# Altium project sonata-board.PrjPcb (part 2 of 2)

## Sheet sb-sonata-fpganaalog.SchDoc: FPGA Analog + 1.8V Bank
size Letter; Organization: NewAE Technology Inc.; Address1: 1083 Queen St., Suite 196; Address2: Halifax; Address3: NS; Address4: Canada B3H 0B2; SheetNumber: 15; SheetTotal: 20; SheetApproved: YES
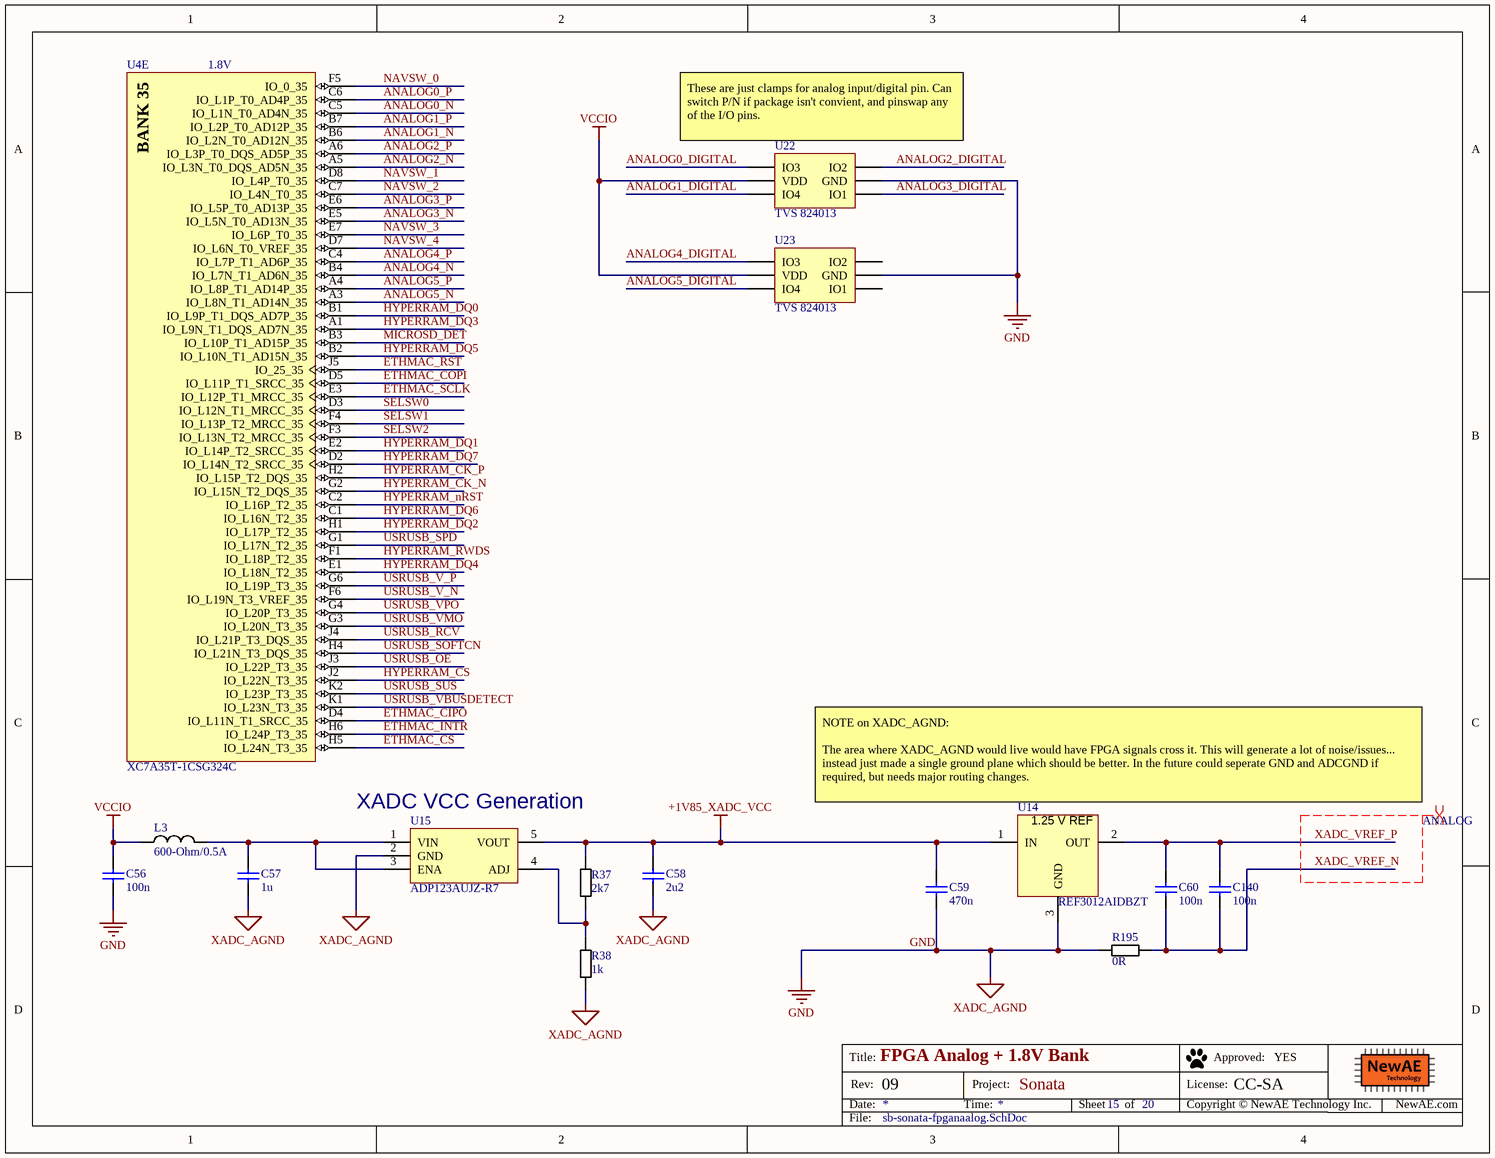
[diagram p6: sb-sonata-fpganaalog.SchDoc]

### Parts
C56  100n  [CAPC0402_M]
C57  1u  [CAPC0603_M]
C58  2u2  [CAPC0603_M]
C59  470n  [CAPC0603_M]
C60  100n  [CAPC0402_M]
C140  100n  [CAPC0402_M]
L3  600-Ohm/0.5A  [IND_0603]
R37  2k7  [RESC1005X40N]
R38  1k  [RESC1005X40N]
R195  0R  [RESC1005X40N]
U4  XC7A35T-1CSG324C  [CSG324]  (part E of 9)
U14  REF3012AIDBZT  [SOT95P237X112-3N]
U15  Linear Voltage Regulator IC  1 Output  300mA TSOT-5  [SOT23-5P95_285X145L45X40]  (value not drawn)
U22  TVS 824013  [SOT95P280X145-6N]
U23  TVS 824013  [SOT95P280X145-6N]

### Nets
+1V85_XADC_VCC: C58.1 C59.1 R37.1 U14.1(IN) U15.5(VOUT)
GND: C56.2 C57.2 C58.2 C59.2 R38.2 R195.1 U14.3(GND) U15.2(GND) U22.2(GND) U23.2(GND)  [also labelled XADC_AGND]
VCCIO: C56.1 L3.1 U22.5(VDD) U23.5(VDD)  [project net 3V3_FTDI]
ANALOG0_DIGITAL: U22.4(IO3)
ANALOG0_N: U4.C5(IO_L1N_T0_AD4N_35)
ANALOG0_P: U4.C6(IO_L1P_T0_AD4P_35)
ANALOG1_DIGITAL: U22.6(IO4)
ANALOG1_N: U4.B6(IO_L2N_T0_AD12N_35)
ANALOG1_P: U4.B7(IO_L2P_T0_AD12P_35)
ANALOG2_DIGITAL: U22.3(IO2)
ANALOG2_N: U4.A5(IO_L3N_T0_DQS_AD5N_35)
ANALOG2_P: U4.A6(IO_L3P_T0_DQS_AD5P_35)
ANALOG3_DIGITAL: U22.1(IO1)
ANALOG3_N: U4.E5(IO_L5N_T0_AD13N_35)
ANALOG3_P: U4.E6(IO_L5P_T0_AD13P_35)
ANALOG4_DIGITAL: U23.4(IO3)
ANALOG4_N: U4.B4(IO_L7N_T1_AD6N_35)
ANALOG4_P: U4.C4(IO_L7P_T1_AD6P_35)
ANALOG5_DIGITAL: U23.6(IO4)
ANALOG5_N: U4.A3(IO_L8N_T1_AD14N_35)
ANALOG5_P: U4.A4(IO_L8P_T1_AD14P_35)
ETHMAC_CIPO: U4.D4(IO_L11N_T1_SRCC_35)
ETHMAC_COPI: U4.D5(IO_L11P_T1_SRCC_35)
ETHMAC_CS: U4.H5(IO_L24N_T3_35)
ETHMAC_INTR: U4.H6(IO_L24P_T3_35)
ETHMAC_RST: U4.J5(IO_25_35)
ETHMAC_SCLK: U4.E3(IO_L12P_T1_MRCC_35)
HYPERRAM_CK_N: U4.G2(IO_L15N_T2_DQS_35)
HYPERRAM_CK_P: U4.H2(IO_L15P_T2_DQS_35)
HYPERRAM_CS: U4.J2(IO_L22N_T3_35)
HYPERRAM_DQ0: U4.B1(IO_L9P_T1_DQS_AD7P_35)
HYPERRAM_DQ1: U4.E2(IO_L14P_T2_SRCC_35)
HYPERRAM_DQ2: U4.H1(IO_L17P_T2_35)
HYPERRAM_DQ3: U4.A1(IO_L9N_T1_DQS_AD7N_35)
HYPERRAM_DQ4: U4.E1(IO_L18N_T2_35)
HYPERRAM_DQ5: U4.B2(IO_L10N_T1_AD15N_35)
HYPERRAM_DQ6: U4.C1(IO_L16N_T2_35)
HYPERRAM_DQ7: U4.D2(IO_L14N_T2_SRCC_35)
HYPERRAM_nRST: U4.C2(IO_L16P_T2_35)
HYPERRAM_RWDS: U4.F1(IO_L18P_T2_35)
MICROSD_DET: U4.B3(IO_L10P_T1_AD15P_35)
NAVSW_0: U4.F5(IO_0_35)
NAVSW_1: U4.D8(IO_L4P_T0_35)
NAVSW_2: U4.C7(IO_L4N_T0_35)
NAVSW_3: U4.E7(IO_L6P_T0_35)
NAVSW_4: U4.D7(IO_L6N_T0_VREF_35)
SELSW0: U4.D3(IO_L12N_T1_MRCC_35)
SELSW1: U4.F4(IO_L13P_T2_MRCC_35)
SELSW2: U4.F3(IO_L13N_T2_MRCC_35)
USRUSB_OE: U4.J3(IO_L22P_T3_35)
USRUSB_RCV: U4.J4(IO_L21P_T3_DQS_35)
USRUSB_SOFTCN: U4.H4(IO_L21N_T3_DQS_35)
USRUSB_SPD: U4.G1(IO_L17N_T2_35)
USRUSB_SUS: U4.K2(IO_L23P_T3_35)
USRUSB_V_N: U4.F6(IO_L19N_T3_VREF_35)
USRUSB_V_P: U4.G6(IO_L19P_T3_35)
USRUSB_VBUSDETECT: U4.K1(IO_L23N_T3_35)
USRUSB_VMO: U4.G3(IO_L20N_T3_35)
USRUSB_VPO: U4.G4(IO_L20P_T3_35)
XADC_VREF_N: C60.2 C140.2 R195.2
XADC_VREF_P: C60.1 C140.1 U14.2(OUT)
NetC57_1: C57.1 L3.2 U15.1(VIN) U15.3(ENA)
NetR37_2: R37.2 R38.1 U15.4(ADJ)

Not connected (* = marked no-connect by the designer): U23 1(IO1) 3(IO2)

### Layout directives
differential pair; differential pair class ANALOG: XADC_VREF_N, XADC_VREF_P

### Notes on the sheet
- 1.8V
- (near U22) These are just clamps for analog input/digital pin. Can switch P/N if package isn't convient, and pinswap any of the I/O pins.
- (near U15) XADC VCC Generation
- (near U14) NOTE on XADC_AGND:
  The area where XADC_AGND would live would have FPGA signals cross it. This will generate a lot of noise/issues... instead just made a single ground plane which should be better. In the future could seperate GND and ADCGND if required, but needs major routing changes.
- Title:
- Date:
- Rev:
- Time:
- Project:
- Sheet
- of
- License:
- Copyright © NewAE Technology Inc.
- Approved:
- NewAE.com
- File:
- (in symbol CMP-0383-00012-1, part E) BANK 35
- (in symbol REF3012AIDBZT) 1.25 V REF

### Library data of the parts
C56 C60 C140 = CCHIP-100n-0402: 100n, 0402; Manufacture Part Number 1: CGA2B3X7R1V104K050BB; Component Group: Capacitor; Case-EIA: 0402; Part Number: CCHIP-100n-0402; Footprint: 0402; Pin Count: 2; Value: 100n; Mounting Technology: SMT; Component Kind: Standard; Component Type: Standard; Supplier 1: Digi-Key; Supplier Part Number 1: 445-6901-1-ND
C57 = CCHIP-1u-0603: 1u, 0603, 50V; Manufacture Part Number 1: CL10A105KB8NNNC; Component Group: Capacitor; Case-EIA: 0603; Case-Metric: 1608; Rated Voltage: 50VDC; Part Number: CCHIP-1u-0603; Footprint: 0603; Pin Count: 2; Supplier 1: Digi-Key; Supplier Part Number 1: 1276-1860-1-ND; Value: 1u; Mounting Technology: SMT; Component Kind: Standard; Component Type: Standard
C58 = CCHIP-2u2-0603-25V: 2u2, 0603; Manufacture 1: Murata Electronics North America; Manufacture Part Number 1: GRM188R61E225MA12D; Component Group: Capacitor; Case-EIA: 0603; Case-Metric: 1608; Rated Voltage: 25VDC; Tolerance: ±20%; Part Number: CCHIP-2u2-0603-25V; Footprint: 0603; Pin Count: 2; Supplier 1: Digi-Key; Supplier Part Number 1: 490-12738-1-ND; Value: 2u2; Mounting Technology: SMT; RoHS: Yes; Component Kind: Standard; Component Type: Standard
C59 = CCHIP-470n-0603-50V: 470n, 0603, 50V; Manufacture 1: Taiyo Yuden; Manufacture Part Number 1: UMK107B7474KA-TR; Component Group: Capacitor; Case-EIA: 0603; Rated Voltage: 50VDC; Part Number: CCHIP-470n-0603-50V; Footprint: 0603; Pin Count: 2; Supplier 1: Digi-Key; Supplier Part Number 1: 587-3170-1-ND; Value: 470n; Mounting Technology: SMT; RoHS: Yes; Temperature Range: -55C to 125C; Component Kind: Standard; Component Type: Standard
L3 = FBCHIP-600R-0603: 600 Ohm @ 100 MHz, 0.5A rated FB; Manufacture 1: Murata Electronics; Manufacture Part Number 1: BLM18AG601SN1D; Component Group: Inductor; Value: 600R/0.5A; Case-EIA: 0603; Case-Metric: 1608; PP Material Stack: 0; Part Number: FBCHIP-600R-0603; Footprint: 0603; Pin Count: 2; Supplier 1: Digi-Key; Supplier Part Number 1: 490-1014-2-ND; Rated Power: 0.5A; Component Kind: Standard; Component Type: Standard; PP Rotation: 0
R37 = RCHIP-2K7-0402: 2k7 res, 0402, 1%, 1/16W; Manufacture 1: Yageo; Manufacture Part Number 1: RC0402FR-072K7L; Component Group: Resistor; Case-EIA: 0402; Case-Metric: 1005; Rated Power: 0.063W; Rated Voltage: 75VDC; Part Number: RCHIP-2K7-0402; Footprint: 0402; Pin Count: 2; Supplier 1: Digi-Key; Supplier Part Number 1: 311-2.70KLRCT-ND; Value: 2k7; Tolerance: 1%; Mounting Technology: SMT; Temperature Range: -55C to 155C; Component Kind: Standard; Component Type: Standard
R38 = RCHIP-1K-0402: 1k res, 0402, 1%, 1/16W; Manufacture 1: Yageo; Manufacture Part Number 1: RC0402FR-071KL; Component Group: Resistor; Case-EIA: 0402; Case-Metric: 1005; Rated Power: 0.063W; Rated Voltage: 75VDC; Part Number: RCHIP-1K-0402; Footprint: 0402; Pin Count: 2; Supplier 1: Digi-Key; Supplier Part Number 1: 311-1.00KLRCT-ND; Value: 1k; Tolerance: 1%; Mounting Technology: SMT; Temperature Range: -55C to 155C; Component Kind: Standard; Component Type: Standard
R195 = RCHIP-0R-0402: 2 ohm; Manufacture 1: Yageo; Manufacture Part Number 1: RC0402FR-070RL; Component Group: Resistor; Case-EIA: 0402; Case-Metric: 1005; Part Number: RCHIP-0R-0402; Footprint: 0402; Pin Count: 2; Supplier 1: Digi-Key; Supplier Part Number 1: 311-0.0LRCT-ND; Value: 0R; Component Kind: Standard; Component Type: Standard
U4 = CMP-0383-00012-1: Artix-7 FPGA, 210 User I/Os, 0 GTP, 324-Ball BGA, Speed Grade 1, Commercial Grade, Pb-Free; Manufacturer: Xilinx; GTP: 0; Available User I/O: 210; Speed Grades: 1; Logic Cells: 33280; Total Block RAM: 1800 Kb; CMTs: 5; Maximum Distributed RAM: 400 Kb; ComponentLink2URL: http://www.xilinx.com/support/documentation/data_sheets/ds180_7Series_Overview.pdf; ComponentLink2Description: Datasheet; DatasheetVersion: Rev. 1.15; PackageDescription: 324-Ball Wire-Bond Chip-Scale BGA, Body 15 x 15 mm, Pitch 0.8 mm; ComponentLink4URL: http://www.xilinx.com/support/documentation/user_guides/ug475_7Series_Pkg_Pinout.pdf; PackageReference: CSG-324; Mounting Technology: Surface Mount; PackageVersion: Rev. 1.11; ComponentLink1Description: Manufacturer URL; ComponentLink3Description: Pinout; ComponentLink1URL: http://www.xilinx.com/; ComponentLink3URL: http://www.xilinx.com/support/documentation/user_guides/ug475_7Series_Pkg_Pinout.pdf; PartNumber: XC7A35T-1CSG324C; ComponentLink4Description: Package Specification; Operating Temperature Range: Commercial
U14 = REF3012AIDBZT: IC VREF SERIES 0.2% SOT23-3; Manufacture 1: Texas Instruments; Output Voltage: 1.25V; Max Input Voltage: 5.5V; Max Output Current: 25mA; Min Input Voltage: 1.8V; Nominal Supply Current: 42uA; Temperature Coefficient: 50ppm/°C; Number of Channels: 1; Quiescent Current: 50uA; Min Output Voltage: 1.248V; Reference Type: Series,Fixed; Component Group: Analog IC; PP Material Stack: 0; Supplier 1: Digi-Key; RoHS: Yes; Category: Voltage References; Stock 1: 7831; Pricing 1: 1=1.18000, 10=1.05300, 25=0.99960, 100=0.76760 (USD); Case/Package: SOT-23; Number of Pins: 3; Min Operating Temperature: -40°C; Max Operating Temperature: 125°C; Packaging: Tape and Reel; Package Quantity: 1; Output Current: 25mA; Max Supply Current: 50uA; Max Output Voltage: 1.25V; Reference Voltage: 1.25V; Termination: SMD/SMT; Length: 2.92mm; Width: 1.3mm; Height: 1mm; Radiation Hardening: No; REACH SVHC: No SVHC; Lead Free: Lead Free; ComponentLink3URL: https://datasheet.ciiva.com/2007/ref3012-2007154.pdf?src-supplier=Digi-Key; ComponentLink3Description: https://datasheet.ciiva.com/2007/ref3012-2007154.pdf?src-supplier=Digi-Key; ComponentLink4URL: https://datasheet.ciiva.com/2007/ref3012-2007155.pdf?src-supplier=Digi-Key; ComponentLink4Description: https://datasheet.ciiva.com/2007/ref3012-2007155.pdf?src-supplier=Digi-Key; ComponentLink5URL: https://datasheet.ciiva.com/3235/ref3033-3235533.pdf?src-supplier=Avnet; ComponentLink5Description: https://datasheet.ciiva.com/3235/ref3033-3235533.pdf?src-supplier=Avnet; ComponentLink6URL: https://datasheet.ciiva.com/3235/ref3033-3235534.pdf?src-supplier=Avnet; ComponentLink6Description: https://datasheet.ciiva.com/3235/ref3033-3235534.pdf?src-supplier=Avnet; .Checked SCH: *; .Checked PCB: *; Supplier Part Number 1: REF3012AIDBZTTR-ND; Manufacturer Part Number: REF3012AIDBZT; Part Number: REF3012AIDBZT; Footprint: SOT23-3; Manufacture Part Number 1: REF3012AIDBZT; Pin Count: 3; Mounting Technology: SMT; Component Kind: Standard; Component Type: Standard; PP Rotation: 0
U15 = ADP123AUJZ-R7: IC REG LIN POS ADJ 300MA TSOT5; Manufacture 1: Analog Devices Inc.; Dropout Voltage: 85mV; Output Voltage: 5V; Number of Outputs: 1; Max Input Voltage: 5.5V; Min Input Voltage: 2.3V; Min Current Limit: 350mA; Polarity: Positive; Quiescent Current: 45uA; Reference Voltage: 500mV; Min Output Voltage: 800mV; Accuracy: 1%; Power Supply Rejection Ratio (PSRR): 60dB; Max Supply Current: 170uA; Output Type: Adjustable; Component Group: Analog IC; PP Material Stack: 0; Supplier 1: Digi-Key; Category: Voltage Regulators - Linear; Stock 1: 14167; Pricing 1: 1=1.16000, 10=1.03300, 25=0.98000, 100=0.75250, 250=0.66500, 500=0.63000, 1000=0.49000 (USD); Case/Package: TSOT; Number of Pins: 5; Contact Plating: Tin,Matte; Min Operating Temperature: -40°C; Max Operating Temperature: 125°C; Output Current: 300mA; Max Output Current: 300mA; Packaging: Tape and Reel; Number of Regulators: 1; Max Output Voltage: 5V; Output Voltage Accuracy: 1%; Nominal Supply Current: 45uA; Operating Supply Current: 45uA; Length: 2.9mm; Width: 1.6mm; Height: 0.9mm; REACH SVHC: No SVHC; Lead Free: Contains Lead; ComponentLink3URL: https://datasheet.ciiva.com/2040/adp122-123-2040698.pdf?src-supplier=Digi-Key; ComponentLink3Description: https://datasheet.ciiva.com/2040/adp122-123-2040698.pdf?src-supplier=Digi-Key; ComponentLink4URL: https://datasheet.ciiva.com/2040/adp122-123-2040699.pdf?src-supplier=Digi-Key; ComponentLink4Description: https://datasheet.ciiva.com/2040/adp122-123-2040699.pdf?src-supplier=Digi-Key; Supplier Part Number 1: ADP123AUJZ-R7TR-ND; .Checked SCH: *; .Checked PCB: *; Manufacturer Part Number: ADP123AUJZ-R7; Part Number: ADP123AUJZ-R7; Manufacture Part Number 1: ADP123AUJZ-R7; Pin Count: 5; Mounting Technology: SMT; Component Kind: Standard; Component Type: Standard; PP Rotation: 0; Footprint: SOT23-5
U22 U23 = TVS_4IO_3v3: TVS DIODE 3.3V 6V SOT23-6L; Manufacture 1: Wurth Electronics Inc.; Manufacture Part Number 1: 824013; Component Group: Analog IC; PP Material Stack: 0; Part Number: TVS_4IO_3v3; Footprint: SOT-23-6; Pin Count: 6; Supplier 1: Digi-Key; Supplier Part Number 1: 732-4466-1-ND; Mounting Technology: SMT; RoHS: Yes; Component Kind: Standard; Component Type: Standard; PP Rotation: 0

## Sheet sb-sonata-psu.SchDoc: Switch-mode PSU
size Letter; Organization: NewAE Technology Inc.; Address1: 1083 Queen St., Suite 196; Address2: Halifax; Address3: NS; Address4: Canada B3H 0B2; SheetNumber: 17; SheetTotal: 20; SheetApproved: YES
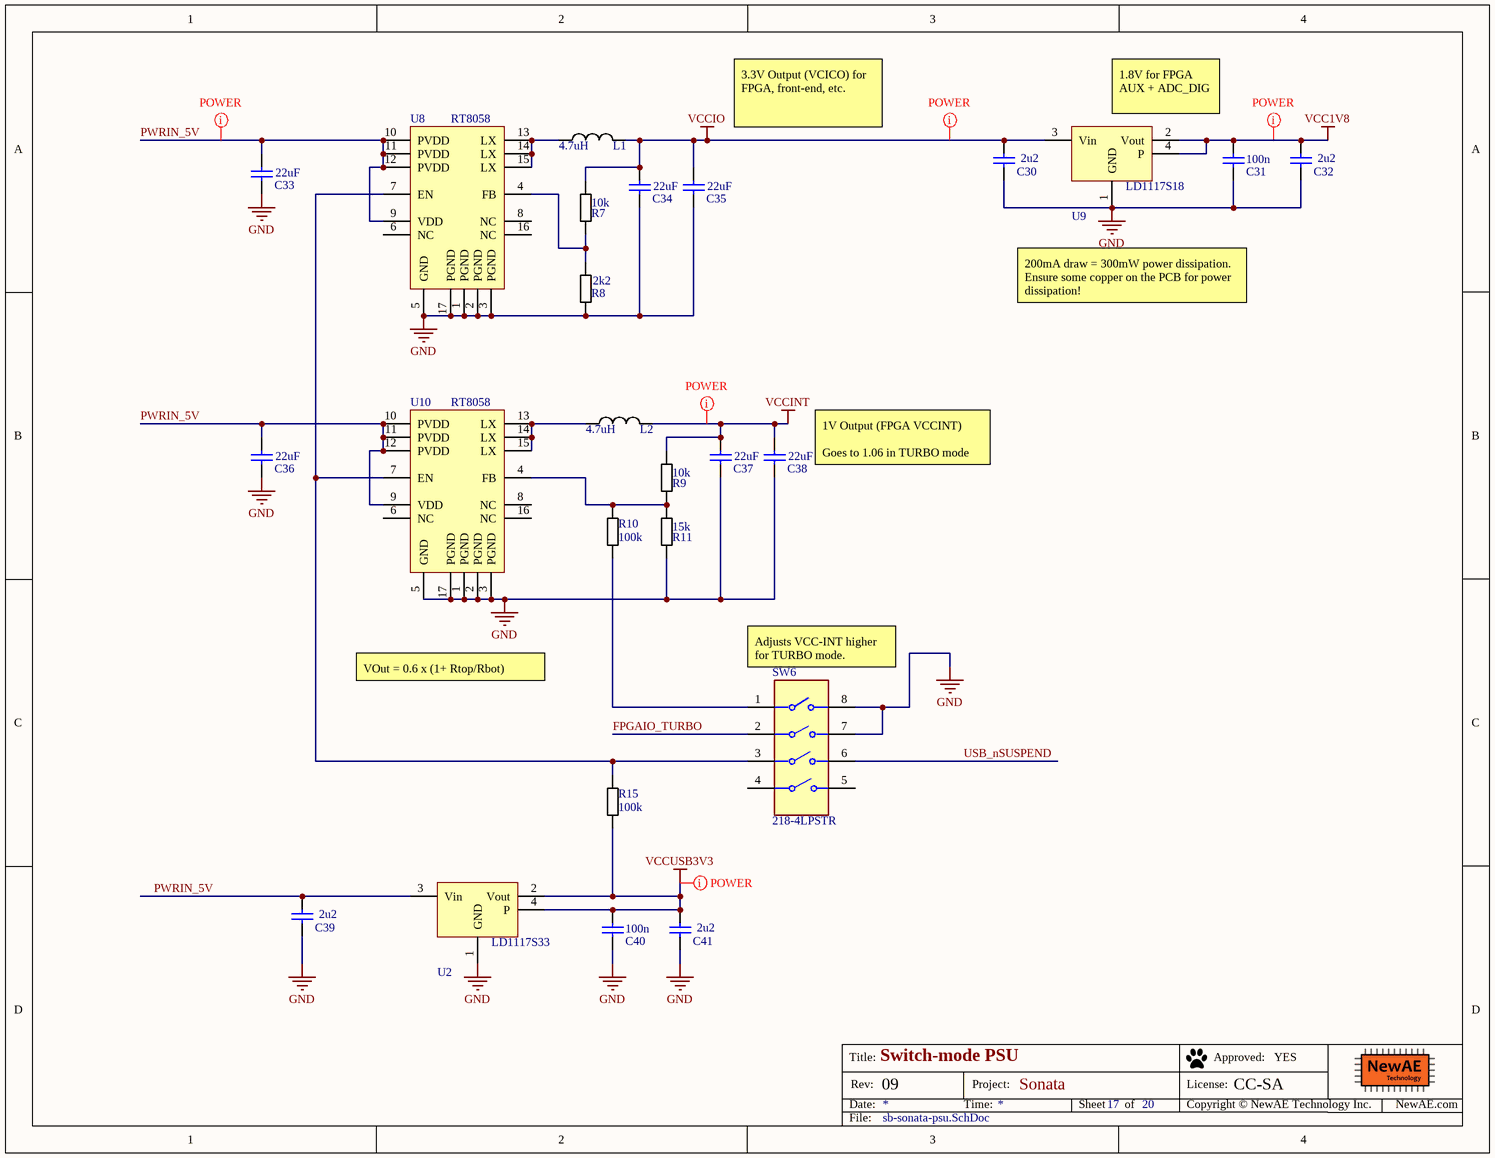
[diagram p7: sb-sonata-psu.SchDoc]

### Parts
C30  2u2  [CAPC0603_M]
C31  100n  [CAPC0402_M]
C32  2u2  [CAPC0603_M]
C33  22uF  [CAPC0805_M]
C34  22uF  [CAPC0805_M]
C35  22uF  [CAPC0805_M]
C36  22uF  [CAPC0805_M]
C37  22uF  [CAPC0805_M]
C38  22uF  [CAPC0805_M]
C39  2u2  [CAPC0603_M]
C40  100n  [CAPC0402_M]
C41  2u2  [CAPC0603_M]
L1  4.7uH  [NR6028]
L2  4.7uH  [NR6028]
R7  10k  [RESC1005X40N]
R8  2k2  [RESC1005X40N]
R9  10k  [RESC1005X40N]
R10  100k  [RESC1005X40N]
R11  15k  [RESC1005X40N]
R15  100k  [RESC1608X55N]
SW6  218-4LPSTR  [FP-218-4LPSTR-MFG]
U2  LD1117S33  [SOT-223]
U8  RT8058  [QFN16_50P300X300X100_HS-17M]
U9  LD1117S18  [SOT-223]
U10  RT8058  [QFN16_50P300X300X100_HS-17M]

### Nets
GND: C30.2 C31.2 C32.2 C33.2 C34.2 C35.2 C36.2 C37.2 C38.2 C39.2 C40.2 C41.2 R8.2 R11.2 SW6.7 SW6.8 U2.1(GND) U8.1(PGND) U8.2(PGND) U8.3(PGND) U8.5(GND) U8.17(PGND) U9.1(GND) U10.1(PGND) U10.2(PGND) U10.3(PGND) U10.5(GND) U10.17(PGND)
VCC1V8: C31.1 C32.1 U9.2(Vout) U9.4(P)
VCCINT: C37.1 C38.1 L2.2 R9.1
VCCIO: C30.1 C34.1 C35.1 L1.2 R7.1 U9.3(Vin)  [project net 3V3_FTDI]
VCCUSB3V3: C40.1 C41.1 R15.1 U2.2(Vout) U2.4(P)
FPGAIO_TURBO: SW6.2
PWRIN_5V: C33.1 C36.1 C39.1 U2.3(Vin) U8.9(VDD) U8.10(PVDD) U8.11(PVDD) U8.12(PVDD) U10.9(VDD) U10.10(PVDD) U10.11(PVDD) U10.12(PVDD)
USB_nSUSPEND: SW6.6
NetL1_1: L1.1 U8.13(LX) U8.14(LX) U8.15(LX)
NetL2_1: L2.1 U10.13(LX) U10.14(LX) U10.15(LX)
NetR7_2: R7.2 R8.1 U8.4(FB)
NetR9_2: R9.2 R10.1 R11.1 U10.4(FB)
NetR10_2: R10.2 SW6.1
NetR15_2: R15.2 SW6.3 U8.7(EN) U10.7(EN)

Not connected (* = marked no-connect by the designer): SW6 4 5; U8 6(NC) 8(NC) 16(NC); U10 6(NC) 8(NC) 16(NC)

### Layout directives
net class Power: 3V3_FTDI, PWRIN_5V, VCC1V8, VCCINT, VCCUSB3V3

### Notes on the sheet
- 3.3V Output (VCICO) for FPGA, front-end, etc.
- 1.8V for FPGA AUX + ADC_DIG
- 200mA draw = 300mW power dissipation. Ensure some copper on the PCB for power dissipation!
- (near C38) 1V Output (FPGA VCCINT)
  Goes to 1.06 in TURBO mode
- VOut = 0.6 x (1+ Rtop/Rbot)
- (near SW6) Adjusts VCC-INT higher for TURBO mode.
- Title:
- Date:
- Rev:
- Time:
- Project:
- Sheet
- of
- License:
- Copyright © NewAE Technology Inc.
- Approved:
- NewAE.com
- File:

### Library data of the parts
C30 C32 C39 C41 = CCHIP-2u2-0603: 2u2, 0603; Manufacture 1: Samsung; Manufacture Part Number 1: CL10B225KP8NNNC; Component Group: Capacitor; Case-EIA: 0603; Case-Metric: 1608; Rated Voltage: 10VDC; Part Number: CCHIP-2u2-0603; Footprint: 0603; Pin Count: 2; Supplier 1: Digi-Key; Supplier Part Number 1: 1276-1134-2-ND; Value: 2u2; Mounting Technology: SMT; Component Kind: Standard; Component Type: Standard
C31 C40 = CCHIP-100n-0402: 100n, 0402; Component Group: Capacitor; Case-EIA: 0402; Part Number: CCHIP-100n-0402; Footprint: 0402; Pin Count: 2; Value: 100n; Mounting Technology: SMT; Component Kind: Standard; Component Type: Standard; Supplier 1: Digi-Key; Supplier Part Number 1: 445-6901-1-ND
C33-C38 = CCHIP-22u-0805-16V: 22u, 16V, 0805, Ceramic; Manufacture 1: Samsung Electro-Mechanics; Manufacture Part Number 1: CL21A226MOCLRNC; Component Group: Capacitor; Case-EIA: 0805; Case-Metric: 1608; Rated Voltage: 16VDC; Tolerance: 20%; Part Number: CCHIP-22u-0805-16V; Footprint: 0805; Pin Count: 2; Supplier 1: Digi-Key; Supplier Part Number 1: 1276-6780-1-ND; Value: 22uF; Mounting Technology: SMT; RoHS: Yes; Component Kind: Standard; Component Type: Standard
L1 L2 = NR6028T4R7M: fixed ind, ferrite, shielded; Manufacture 1: Taiyo Yuden; Component Group: Inductor; Case-Metric: 6060; Part Number: NR6028T4R7M; Footprint: SMD,6x6mm; Manufacture Part Number 1: NR6028T4R7M; Pin Count: 2; Supplier 1: Digi-Key; Supplier Part Number 1: 587-2100-1-ND; Value: 4.7uH; Mounting Technology: SMT; Component Kind: Standard; Component Type: Standard
R7 R9 = RCHIP-10K-0402: 10k res, 0402, 1%, 1/16W; Manufacture 1: Yageo; Manufacture Part Number 1: RC0402FR-0710KL; Component Group: Resistor; Case-EIA: 0402; Case-Metric: 1005; Rated Power: 0.063W; Rated Voltage: 75VDC; Part Number: RCHIP-10K-0402; Footprint: 0402; Pin Count: 2; Supplier 1: Digi-Key; Supplier Part Number 1: 311-10.0KLRCT-ND; Value: 10k; Tolerance: 1%; Mounting Technology: SMT; Temperature Range: -55C to 155C; Component Kind: Standard; Component Type: Standard
R8 = RCHIP-2K2-0402: 2k2 res, 0402, 1%, 1/16W; Manufacture 1: Yageo; Manufacture Part Number 1: RC0402FR-072K2L; Component Group: Resistor; Case-EIA: 0402; Case-Metric: 1005; Rated Power: 0.063W; Rated Voltage: 75VDC; Part Number: RCHIP-2K2-0402; Footprint: 0402; Pin Count: 2; Supplier 1: Digi-Key; Supplier Part Number 1: 311-2.20KLRCT-ND; Value: 2k2; Tolerance: 1%; Mounting Technology: SMT; Temperature Range: -55C to 155C; Component Kind: Standard; Component Type: Standard
R10 = RCHIP-100K-0402: 100k res, 0402, 1%, 1/16W; Manufacture 1: Yageo; Manufacture Part Number 1: RC0402FR-07100KL; Component Group: Resistor; Case-EIA: 0402; Case-Metric: 1005; Rated Power: 0.063W; Rated Voltage: 75VDC; Part Number: RCHIP-100K-0402; Footprint: 0402; Pin Count: 2; Supplier 1: Digi-Key; Supplier Part Number 1: 311-100KLRCT-ND; Value: 100k; Tolerance: 1%; Mounting Technology: SMT; Temperature Range: -55C to 155C; Component Kind: Standard; Component Type: Standard
R11 = RCHIP-15K-0402: 15k res, 0402, 1%, 1/16W; Manufacture 1: Yageo; Manufacture Part Number 1: RC0402FR-0715KL; Component Group: Resistor; Case-EIA: 0402; Case-Metric: 1005; Rated Power: 0.063W; Rated Voltage: 75VDC; Part Number: RCHIP-15K-0402; Footprint: 0402; Pin Count: 2; Supplier 1: Digi-Key; Supplier Part Number 1: 311-15.0KLRCT-ND; Value: 15k; Tolerance: 1%; Mounting Technology: SMT; Temperature Range: -55C to 155C; Component Kind: Standard; Component Type: Standard
R15 = RCHIP-100K-0603: 100k res, 0603, 1%, 1/10W; Manufacture 1: Yageo; Manufacture Part Number 1: RC0603FR-07100KL; Component Group: Resistor; Case-EIA: 0603; Case-Metric: 1608; Rated Power: 0.1W; Rated Voltage: 75VDC; Part Number: RCHIP-100K-0603; Footprint: 0603; Pin Count: 2; Supplier 1: Digi-Key; Supplier Part Number 1: 311-100KHRCT-ND; Value: 100k; Tolerance: 1%; Mounting Technology: SMT; Temperature Range: -55C to 155C; Component Kind: Standard; Component Type: Standard
SW6 = CMP-07018-000008-1: SWITCH SLIDE DIP SPST 25MA 24V; Number of Positions: 4; Washable: Yes; Pitch: 0.05inch; Actuator Type: Slide (Standard); Electrical Life: 1000Cycles; Current Rating: 25mA; Contact Material: Copper; Max Current Rating: 25mA; Termination: Gull Wing; Throw Configuration: SPST; Mount: Surface Mount; Radiation Hardening: No; Contact Plating: Gold; Length: 0.246inch; Depth: 8.44mm; Package Quantity: 2000; Packaging: Tape and Reel; Series: 218; Lead Free: Lead Free; Voltage Rating (DC): 24V; Min Operating Temperature: -55°C; RoHS Compliant: Yes; Mechanical Life: 1000Cycles; Max Operating Temperature: 85°C; Orientation: Straight; Max Voltage Rating (DC): 24V
U2 = LD1117S33: IC REG LIN POS 3.3V 800MA SOT223; Manufacture 1: STMicroelectronics; Manufacture Part Number 1: LD1117S33TR; Component Group: Analog IC; Rated Voltage: 15V; PP Material Stack: 0; Part Number: LD1117S33; Pin Count: 3; Supplier 1: Digi-Key; Supplier Part Number 1: 497-1242-1-ND; Mounting Technology: SMT; RoHS: Yes; Component Kind: Standard; Component Type: Standard; PP Rotation: 0
U8 U10 = RT8058: Switching supply controller, 2A; Manufacture 1: Richtek; Component Group: Analog IC; PP Material Stack: 0; Part Number: RT8058; Footprint: QFN16; Manufacture Part Number 1: RT8058; Pin Count: 17; Component Kind: Standard; Component Type: Standard; PP Rotation: 0
U9 = LD1117S18: IC REG LIN POS 1.8V 800MA SOT223; Manufacture 1: STMicroelectronics; Manufacture Part Number 1: LD1117S18TR; Component Group: Analog IC; Rated Voltage: 15V; PP Material Stack: 0; Part Number: LD1117S18; Pin Count: 3; Supplier 1: Digi-Key; Supplier Part Number 1: 497-7308-1-ND; Mounting Technology: SMT; RoHS: Yes; Component Kind: Standard; Component Type: Standard; PP Rotation: 0

## Sheet sb-sonata-hyperram.SchDoc: Hyperram
size Letter; Organization: NewAE Technology Inc.; Address1: 1083 Queen St., Suite 196; Address2: Halifax; Address3: NS; Address4: Canada B3H 0B2; SheetNumber: 19; SheetTotal: 20; SheetApproved: YES
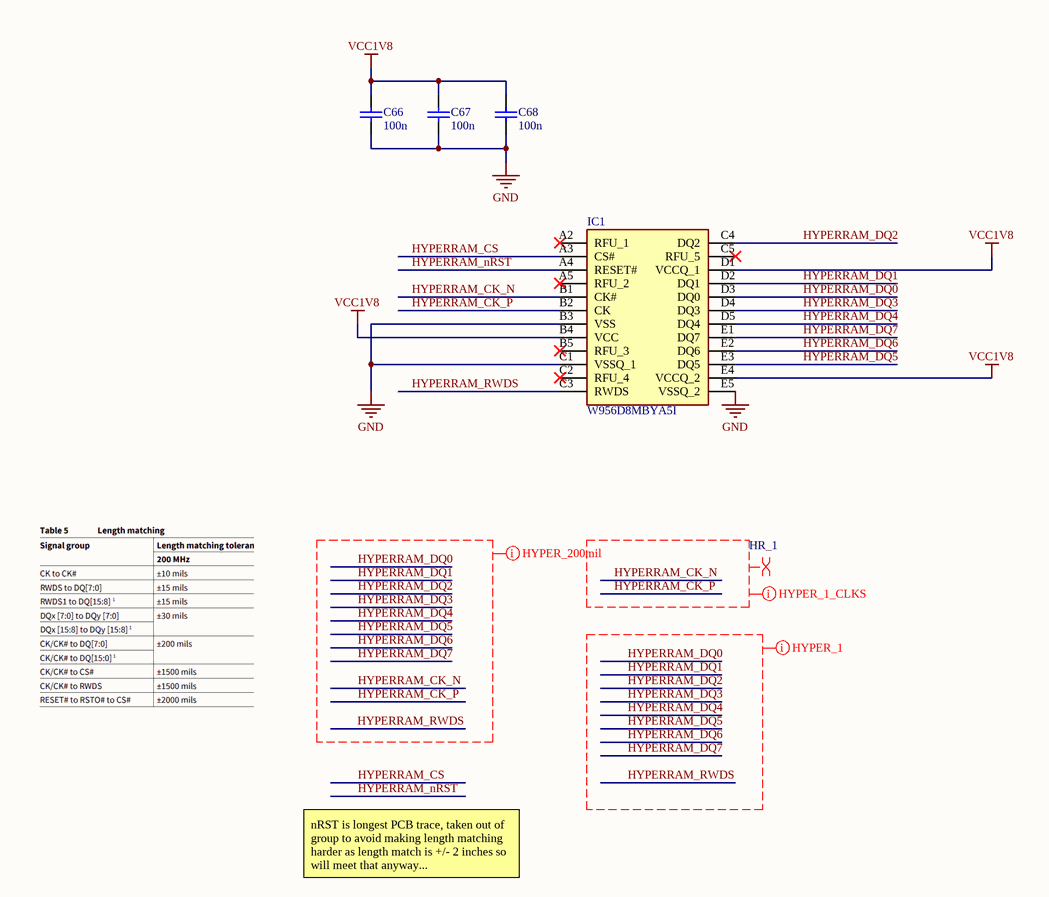
[diagram p8: sb-sonata-hyperram.SchDoc]

### Parts
C66  100n  [CAPC0402_M]
C67  100n  [CAPC0402_M]
C68  100n  [CAPC0402_M]
IC1  W956D8MBYA5I  [BGA24C100P5X5_600X800X120]

### Nets
GND: C66.2 C67.2 C68.2 IC1.B3(VSS) IC1.C1(VSSQ_1) IC1.E5(VSSQ_2)
VCC1V8: C66.1 C67.1 C68.1 IC1.B4(VCC) IC1.D1(VCCQ_1) IC1.E4(VCCQ_2)
HYPERRAM_CK_N: IC1.B1(CK#)
HYPERRAM_CK_P: IC1.B2(CK)
HYPERRAM_CS: IC1.A3(CS#)
HYPERRAM_DQ0: IC1.D3(DQ0)
HYPERRAM_DQ1: IC1.D2(DQ1)
HYPERRAM_DQ2: IC1.C4(DQ2)
HYPERRAM_DQ3: IC1.D4(DQ3)
HYPERRAM_DQ4: IC1.D5(DQ4)
HYPERRAM_DQ5: IC1.E3(DQ5)
HYPERRAM_DQ6: IC1.E2(DQ6)
HYPERRAM_DQ7: IC1.E1(DQ7)
HYPERRAM_nRST: IC1.A4(RESET#)
HYPERRAM_RWDS: IC1.C3(RWDS)

Not connected (* = marked no-connect by the designer): IC1 A2(RFU_1)* A5(RFU_2)* B5(RFU_3)* C2(RFU_4)* C5(RFU_5)*

### Layout directives
net class HYPER_200mil_Length: HYPERRAM_CK_N, HYPERRAM_CK_P, HYPERRAM_DQ0, HYPERRAM_DQ1, HYPERRAM_DQ2, HYPERRAM_DQ3, HYPERRAM_DQ4, HYPERRAM_DQ5, HYPERRAM_DQ6, HYPERRAM_DQ7, HYPERRAM_RWDS
differential pair; differential pair class HR_1: HYPERRAM_CK_N, HYPERRAM_CK_P
net class HYPER_1_Clks: HYPERRAM_CK_N, HYPERRAM_CK_P
net class HYPER_1_Length: HYPERRAM_DQ0, HYPERRAM_DQ1, HYPERRAM_DQ2, HYPERRAM_DQ3, HYPERRAM_DQ4, HYPERRAM_DQ5, HYPERRAM_DQ6, HYPERRAM_DQ7, HYPERRAM_RWDS

### Notes on the sheet
- nRST is longest PCB trace, taken out of group to avoid making length matching harder as length match is +/- 2 inches so will meet that anyway...
- Title:
- Date:
- Rev:
- Time:
- Project:
- Sheet
- of
- License:
- Copyright © NewAE Technology Inc.
- Approved:
- NewAE.com
- File:

### Library data of the parts
C66-C68 = CCHIP-100n-0402: as C56 on sheet sb-sonata-fpganaalog; Part Number: CCHIP-100n-0402; Footprint: 0402; Pin Count: 2; Value: 100n; Mounting Technology: SMT; Component Kind: Standard; Component Type: Standard; Supplier 1: Digi-Key; Supplier Part Number 1: 445-6901-1-ND
IC1 = W956D8MBYA5I: Integrated Circuit; Manufacturer_Name: Winbond; Datasheet Link: https://www.winbond.com/hq/search-resource-file.jsp?partNo=W956D8MBYA5I&type=datasheet; Height: 1.2mm; Manufacturer_Part_Number: W956D8MBYA5I; Mouser Part Number: 454-W956D8MBYA5I; Mouser Price/Stock: https://www.mouser.co.uk/ProductDetail/Winbond/W956D8MBYA5I?qs=YwPsRIUVAOcvNB%2FM4WBgTQ%3D%3D

## Nets that join several sheets
3V3_FTDI: sb-sonata-usbrp (28 pins), sb-sonata-industriaal (7 pins), sb-sonata-debug (20 pins), sb-sonata-led (R20.1 R193.1), sb-sonata-fpgaio2 (R125.1 R126.1 R127.1 R128.1), sb-sonata-fpganaalog (C56.1 L3.1 U22.5 U23.5), sb-sonata-psu (6 pins)
GND: sb-sonata-usbrp (30 pins), sb-sonata-industriaal (15 pins), sb-sonata-debug (45 pins), sb-sonata-led (45 pins), sb-sonata-fpganaalog (10 pins), sb-sonata-psu (28 pins), sb-sonata-hyperram (6 pins)
VCC1V8: sb-sonata-psu (C31.1 C32.1 U9.2 U9.4), sb-sonata-hyperram (6 pins)
ANALOG0_DIGITAL: sb-sonata-fpgaio2 (U4.G13), sb-sonata-fpganaalog (U22.4)
ANALOG1_DIGITAL: sb-sonata-fpgaio2 (U4.D14), sb-sonata-fpganaalog (U22.6)
ANALOG2_DIGITAL: sb-sonata-fpgaio2 (U4.C14), sb-sonata-fpganaalog (U22.3)
ANALOG3_DIGITAL: sb-sonata-fpgaio2 (U4.C9), sb-sonata-fpganaalog (U22.1)
ANALOG4_DIGITAL: sb-sonata-fpgaio2 (U4.B9), sb-sonata-fpganaalog (U23.4)
ANALOG5_DIGITAL: sb-sonata-fpgaio2 (U4.B8), sb-sonata-fpganaalog (U23.6)
CHERIERR0: sb-sonata-debug (SW2.10), sb-sonata-led (R139.1)
CHERIERR1: sb-sonata-debug (SW2.9), sb-sonata-led (R141.1)
HYPERRAM_CK_N: sb-sonata-fpganaalog (U4.G2), sb-sonata-hyperram (IC1.B1)
HYPERRAM_CK_P: sb-sonata-fpganaalog (U4.H2), sb-sonata-hyperram (IC1.B2)
HYPERRAM_CS: sb-sonata-fpganaalog (U4.J2), sb-sonata-hyperram (IC1.A3)
HYPERRAM_DQ0: sb-sonata-fpganaalog (U4.B1), sb-sonata-hyperram (IC1.D3)
HYPERRAM_DQ1: sb-sonata-fpganaalog (U4.E2), sb-sonata-hyperram (IC1.D2)
HYPERRAM_DQ2: sb-sonata-fpganaalog (U4.H1), sb-sonata-hyperram (IC1.C4)
HYPERRAM_DQ3: sb-sonata-fpganaalog (U4.A1), sb-sonata-hyperram (IC1.D4)
HYPERRAM_DQ4: sb-sonata-fpganaalog (U4.E1), sb-sonata-hyperram (IC1.D5)
HYPERRAM_DQ5: sb-sonata-fpganaalog (U4.B2), sb-sonata-hyperram (IC1.E3)
HYPERRAM_DQ6: sb-sonata-fpganaalog (U4.C1), sb-sonata-hyperram (IC1.E2)
HYPERRAM_DQ7: sb-sonata-fpganaalog (U4.D2), sb-sonata-hyperram (IC1.E1)
HYPERRAM_nRST: sb-sonata-fpganaalog (U4.C2), sb-sonata-hyperram (IC1.A4)
HYPERRAM_RWDS: sb-sonata-fpganaalog (U4.F1), sb-sonata-hyperram (IC1.C3)
NAVSW_0: sb-sonata-led (SW8.1), sb-sonata-fpganaalog (U4.F5)
NAVSW_1: sb-sonata-led (SW8.4), sb-sonata-fpganaalog (U4.D8)
NAVSW_2: sb-sonata-led (SW8.2), sb-sonata-fpganaalog (U4.C7)
NAVSW_3: sb-sonata-led (SW8.3), sb-sonata-fpganaalog (U4.E7)
NAVSW_4: sb-sonata-led (SW8.6), sb-sonata-fpganaalog (U4.D7)
NRST: sb-sonata-usbrp (U11.28), sb-sonata-debug (J4.10 J5.15 SW2.12), sb-sonata-led (R20.2 SW5.2)
PWRIN_5V: sb-sonata-led (R19.2), sb-sonata-psu (12 pins)
RGBLED0: sb-sonata-led (Q3.1 R193.2 R205.1 R210.1), sb-sonata-fpgaio2 (U4.D9)
RP2040_LED3: sb-sonata-usbrp (U11.29), sb-sonata-led (R156.1)
RP2040_RGBLED0: sb-sonata-usbrp (U11.18), sb-sonata-led (R210.2)
SELSW0: sb-sonata-led (SW7.1), sb-sonata-fpganaalog (U4.D3)
SELSW1: sb-sonata-led (SW7.2), sb-sonata-fpganaalog (U4.F4)
SELSW2: sb-sonata-led (SW7.4), sb-sonata-fpganaalog (U4.F3)
USR_JTAG_TCK: sb-sonata-debug (J4.4 J5.9 J5.11 SW2.16), sb-sonata-fpgaio2 (U4.E15)
USR_JTAG_TDI: sb-sonata-debug (J4.8 J5.5 SW2.15), sb-sonata-fpgaio2 (U4.G17)
USR_JTAG_TDO: sb-sonata-debug (J4.6 J5.13 SW2.14), sb-sonata-fpgaio2 (U4.J14)
USR_JTAG_TMS: sb-sonata-debug (J4.2 J5.7 SW2.13), sb-sonata-fpgaio2 (U4.H15)
USR_JTAG_TRST: sb-sonata-debug (J5.3 SW2.11), sb-sonata-fpgaio2 (U4.C16)
USRLED0: sb-sonata-led (R138.1), sb-sonata-fpgaio2 (U4.B13)
USRLED1: sb-sonata-led (R140.1), sb-sonata-fpgaio2 (U4.B14)
USRLED2: sb-sonata-led (R142.1), sb-sonata-fpgaio2 (U4.C12)
USRLED3: sb-sonata-led (R144.1), sb-sonata-fpgaio2 (U4.B12)
USRLED4: sb-sonata-led (R147.1), sb-sonata-fpgaio2 (U4.B11)
USRLED5: sb-sonata-led (R149.1), sb-sonata-fpgaio2 (U4.A11)
USRLED6: sb-sonata-led (R151.1), sb-sonata-fpgaio2 (U4.F13)
USRLED7: sb-sonata-led (R153.1), sb-sonata-fpgaio2 (U4.F14)
USRSW0: sb-sonata-led (SW4.16), sb-sonata-fpgaio2 (U4.D12)
USRSW1: sb-sonata-led (SW4.15), sb-sonata-fpgaio2 (U4.D13)
USRSW2: sb-sonata-led (SW4.14), sb-sonata-fpgaio2 (U4.B16)
USRSW3: sb-sonata-led (SW4.13), sb-sonata-fpgaio2 (U4.B17)
USRSW4: sb-sonata-led (SW4.12), sb-sonata-fpgaio2 (U4.A15)
USRSW5: sb-sonata-led (SW4.11), sb-sonata-fpgaio2 (U4.A16)
USRSW6: sb-sonata-led (SW4.10), sb-sonata-fpgaio2 (U4.A13)
USRSW7: sb-sonata-led (SW4.9), sb-sonata-fpgaio2 (U4.A14)

## Assembly variants
Variant of cheriot-test: not fitted J4